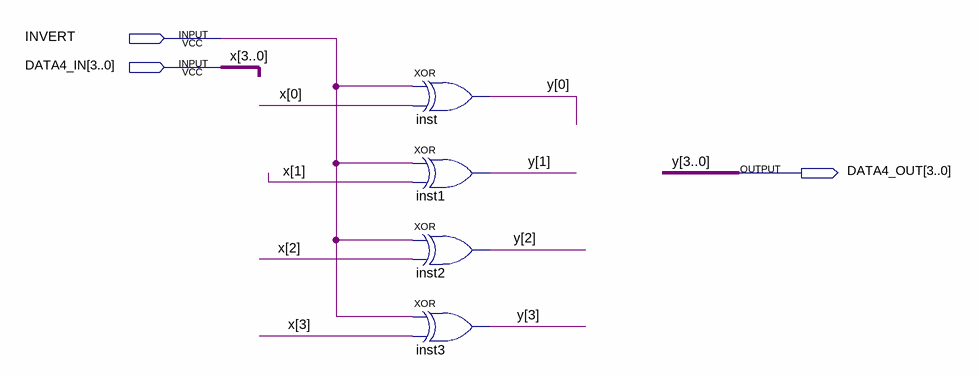
[diagram p0: schematic sheet]
// Quartus schematic INVERT4.bdf as structural Verilog: 4 symbols, 3 pins
module INVERT4 (
  input  INVERT,
  input  [3:0] DATA4_IN,
  output [3:0] DATA4_OUT
);

  xor inst (DATA4_OUT[0], INVERT, DATA4_IN[0]);
  xor inst1 (DATA4_OUT[1], INVERT, DATA4_IN[1]);
  xor inst2 (DATA4_OUT[2], INVERT, DATA4_IN[2]);
  xor inst3 (DATA4_OUT[3], INVERT, DATA4_IN[3]);

  // Other names for the same wires on the sheet: x[3:0] = DATA4_IN; y[3:0] = DATA4_OUT
endmodule
